# Altium project taximeter.PrjPcb
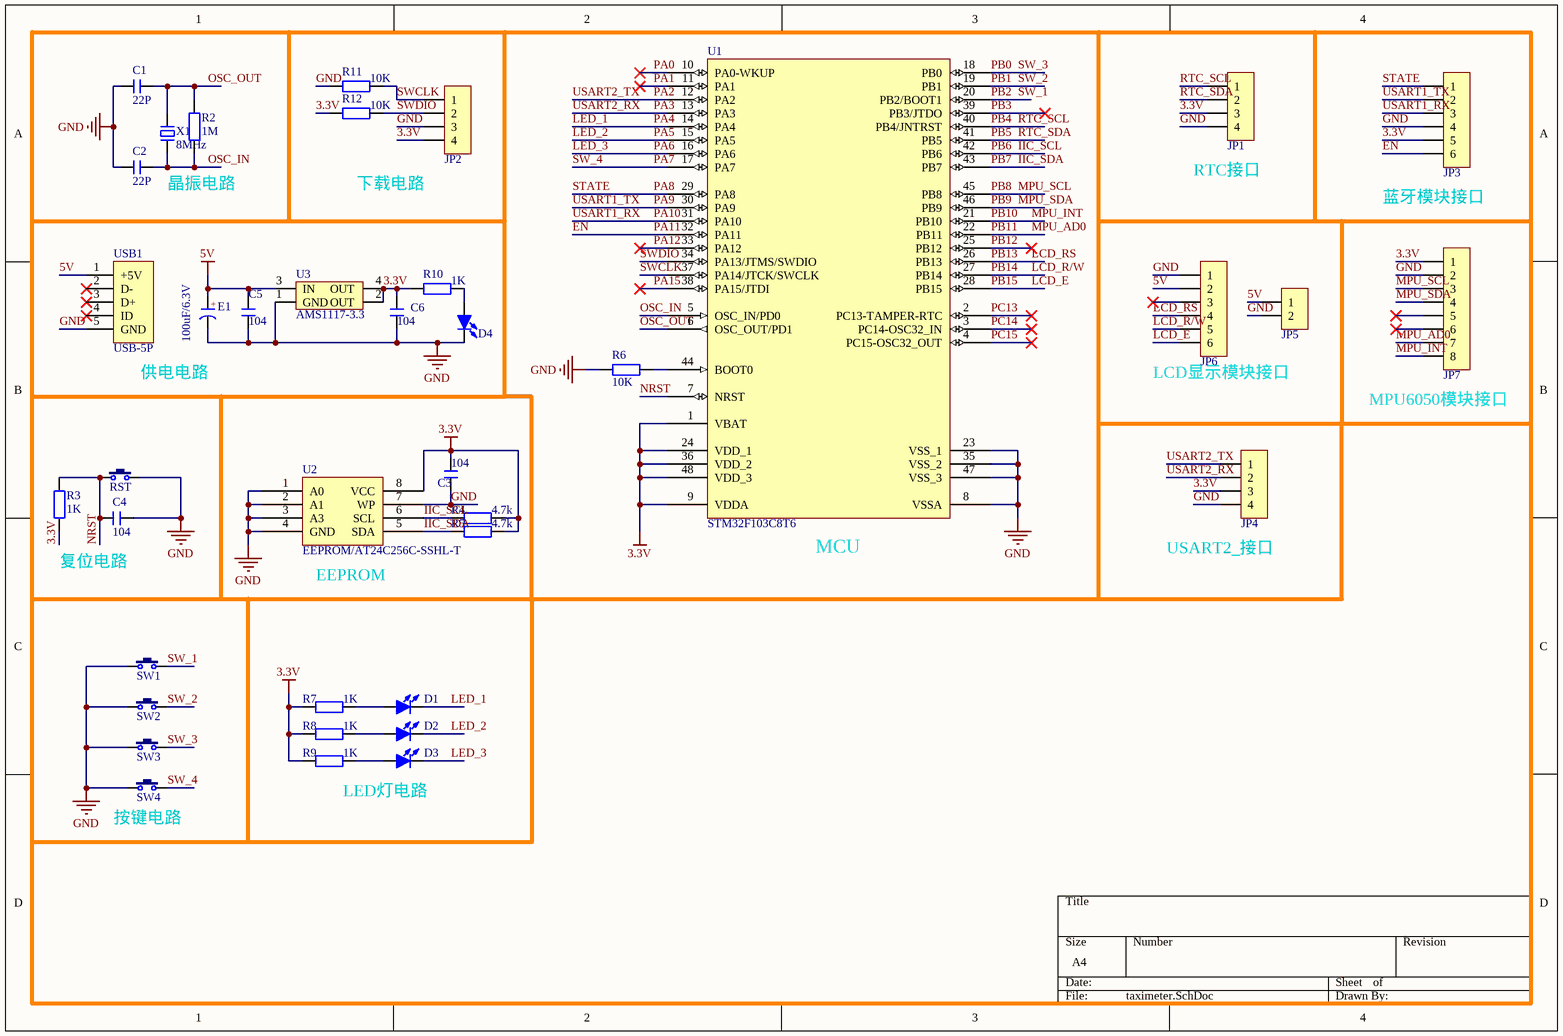
[diagram p0: taximeter.SchDoc]
1 sheet, 39 parts. Net scope: global (net labels, ports and power ports of the same name join across sheets).
Board file: taximeter.PcbDoc

## Sheet taximeter.SchDoc
size A4

### Parts
C1  22P  [C 0805]
C2  22P  [C 0805]
C3  104  [C 0805]
C4  104  [C 0805]
C5  104  [C 0805]
C6  104  [C 0805]
D1  蓝色  [LED 0805G]  (value not drawn)
D2  蓝色  [LED 0805G]  (value not drawn)
D3  蓝色  [LED 0805G]  (value not drawn)
D4  红色  [LED 0805G]  (value not drawn)
E1  100uF/6.3V  [CD A(3216)]
JP1  HDR-1X4  [HDR-1X4]  (value not drawn)
JP2  HDR-1X4  [HDR-1X4]  (value not drawn)
JP3  HDR-1X6  [HDR-1X6]  (value not drawn)
JP4  HDR-1X4  [HDR-1X4]  (value not drawn)
JP5  HDR-1X2  [HDR-1X2]  (value not drawn)
JP6  HDR-1X6  [HDR-1X6]  (value not drawn)
JP7  HDR-1X8  [HDR-1X8]  (value not drawn)
R2  1M  [R 0805]
R3  1K  [R 0805]
R4  4.7k  [R 0805]
R5  4.7k  [R 0805]
R6  10K  [R 0805]
R7  1K  [R 0805]
R8  1K  [R 0805]
R9  1K  [R 0805]
R10  1K  [R 0805]
R11  10K  [R 0805]
R12  10K  [R 0805]
RST  3x6x5  [TSW DIP-3*6*5_V]  (value not drawn)
SW1  3x6x5  [TSW DIP-3*6*5_V]  (value not drawn)
SW2  3x6x5  [TSW DIP-3*6*5_V]  (value not drawn)
SW3  3x6x5  [TSW DIP-3*6*5_V]  (value not drawn)
SW4  3x6x5  [TSW DIP-3*6*5_V]  (value not drawn)
U1  STM32F103C8T6  [LQFP48 7X7_M]
U2  EEPROM/AT24C256C-SSHL-T  [LC-SOIC-8_150mil]
U3  AMS1117-3.3  [AMS1117]
USB1  USB-5P  [USB-MICRO_B]
X1  8MHz  [XTAL-49S SMD]

### Nets
3.3V: C3.2 C6.2 JP1.3 JP2.4 JP3.5 JP4.3 JP7.1 R3.1 R4.2 R5.2 R7.2 R8.2 R9.2 R10.1 R12.1 U1.1(VBAT) U1.9(VDDA) U1.24(VDD_1) U1.36(VDD_2) U1.48(VDD_3) U2.8(VCC) U3.2(OUT) U3.4(OUT)
5V: C5.2 E1.1(A) JP5.1 JP6.2 U3.3(IN) USB1.1(+5V)
GND: C1.1 C2.1 C3.1 C4.2 C5.1 C6.1 D4.2(K) E1.2(K) JP1.4 JP2.3 JP3.4 JP4.4 JP5.2 JP6.1 JP7.2 R6.1 R11.1 RST.2 SW1.1 SW2.1 SW3.1 SW4.1 U1.8(VSSA) U1.23(VSS_1) U1.35(VSS_2) U1.47(VSS_3) U2.1(A0) U2.2(A1) U2.3(A3) U2.4(GND) U2.7(WP) U3.1(GND) USB1.5(GND)
EN: JP3.6 U1.32(PA11)  [also labelled PA11]
IIC_SCL: R4.1 U1.42(PB6) U2.6(SCL)  [also labelled PB6]
IIC_SDA: R5.1 U1.43(PB7) U2.5(SDA)  [also labelled PB7]
LCD_E: JP6.6 U1.28(PB15)  [also labelled PB15]
LCD_R/W: JP6.5 U1.27(PB14)  [also labelled PB14]
LCD_RS: JP6.4 U1.26(PB13)  [also labelled PB13]
LED_1: D1.2(K) U1.14(PA4)  [also labelled PA4]
LED_2: D2.2(K) U1.15(PA5)  [also labelled PA5]
LED_3: D3.2(K) U1.16(PA6)  [also labelled PA6]
MPU_AD0: JP7.7 U1.22(PB11)  [also labelled PB11]
MPU_INT: JP7.8 U1.21(PB10)  [also labelled PB10]
MPU_SCL: JP7.3 U1.45(PB8)  [also labelled PB8]
MPU_SDA: JP7.4 U1.46(PB9)  [also labelled PB9]
NRST: C4.1 R3.2 RST.1 U1.7(NRST)
OSC_IN: C2.2 R2.2 U1.5(OSC_IN/PD0) X1.2
OSC_OUT: C1.2 R2.1 U1.6(OSC_OUT/PD1) X1.1
PA0: U1.10(PA0-WKUP)
PA1: U1.11(PA1)
PA2: JP4.1 U1.12(PA2)  [also labelled USART2_TX]
PA3: JP4.2 U1.13(PA3)  [also labelled USART2_RX]
PA7: SW4.2 U1.17(PA7)  [also labelled SW_4]
PA8: JP3.1 U1.29(PA8)  [also labelled STATE]
PA9: JP3.2 U1.30(PA9)  [also labelled USART1_TX]
PA10: JP3.3 U1.31(PA10)  [also labelled USART1_RX]
PA12: U1.33(PA12)
PA15: U1.38(PA15/JTDI)
PB0: SW3.2 U1.18(PB0)  [also labelled SW_3]
PB1: SW2.2 U1.19(PB1)  [also labelled SW_2]
PB2: SW1.2 U1.20(PB2/BOOT1)  [also labelled SW_1]
PB3: U1.39(PB3/JTDO)
PB4: JP1.1 U1.40(PB4/JNTRST)  [also labelled RTC_SCL]
PB5: JP1.2 U1.41(PB5)  [also labelled RTC_SDA]
PB12: U1.25(PB12)
PC13: U1.2(PC13-TAMPER-RTC)
PC14: U1.3(PC14-OSC32_IN)
PC15: U1.4(PC15-OSC32_OUT)
SWCLK: JP2.1 R11.2 U1.37(PA14/JTCK/SWCLK)
SWDIO: JP2.2 R12.2 U1.34(PA13/JTMS/SWDIO)
NetD1_1: D1.1(A) R7.1
NetD2_1: D2.1(A) R8.1
NetD3_1: D3.1(A) R9.1
NetD4_1: D4.1(A) R10.2
NetR6_2: R6.2 U1.44(BOOT0)

Not connected (* = marked no-connect by the designer): JP6 3*; JP7 5* 6*; USB1 2(D-)* 3(D+)* 4(ID)*

### Notes on the sheet
- (near JP1) RTC接口
- 晶振电路
- 下载电路
- 蓝牙模块接口
- 供电电路
- (near JP6) LCD显示模块接口
- (near JP7) MPU6050模块接口
- 复位电路
- (near U2) EEPROM
- (near U1) MCU
- (near JP4) USART2_接口
- (near SW4) 按键电路
- LED灯电路
- (in symbol C-CD) +

### Library data of the parts
C1-C6 = C: 无极性贴片电容; 版权归属: 源创客; BOM名称: 无极性贴片电容; 学习资源: www.ooocke.com
D1-D4 = LED-SMD: 贴片LED; 版权归属: 源创客; BOM名称: 贴片LED; 学习资源: www.ooocke.com
E1 = C-CD: 贴片钽电容; 版权归属: 源创客; BOM名称: 贴片钽电容; 学习资源: www.ooocke.com
JP1 JP2 JP4 = Header 4: 4P接插件; 版权归属: 源创客; BOM名称: 4P接插件; 学习资源: www.ooocke.com
JP3 JP6 = Header 6: 6P接插件; 版权归属: 源创客; BOM名称: 6P接插件; 学习资源: www.ooocke.com
JP5 = Header 2: 2P接插件; 版权归属: 源创客; BOM名称: 2P接插件; 学习资源: www.ooocke.com
JP7 = Header 8: 8P接插件; 版权归属: 源创客; BOM名称: 8P接插件; 学习资源: www.ooocke.com
R2-R12 = R: 贴片电阻; 版权归属: 源创客; BOM名称: 贴片电阻; 学习资源: www.ooocke.com
RST SW1-SW4 = TSW 3x6: 3x6轻触开关; 版权归属: 源创客; BOM名称: 3x6轻触开关; 学习资源: www.ooocke.com
U1 = STM32F103C8T6: Flaah:64/RAM:20/IO:36; BOM名称: 32位STM单片机; 版权归属: 源创客; 学习资源: www.ooocke.com
U2 = EEPROM/AT24C256C-SSHL-T: EEPROM; ComponentLink1Description: 供应商链接; ComponentLink1URL: http://www.szlcsc.com/product/details_6947.html; Package: SOIC-8_150mil; Supplier: LC; SuppliersPartNumber: C6482
U3 = AMS1117
USB1 = USB-5P: 微型USB母座; 版权归属: 源创客; BOM名称: 微型USB母座; 学习资源: www.ooocke.com
X1 = XTAL-2: 2脚晶振; 版权归属: 源创客; BOM名称: 2脚晶振; 学习资源: www.ooocke.com